# Altium schematic sheet Power_Management_System.SchDoc: Power Management System (part 2 of 3)
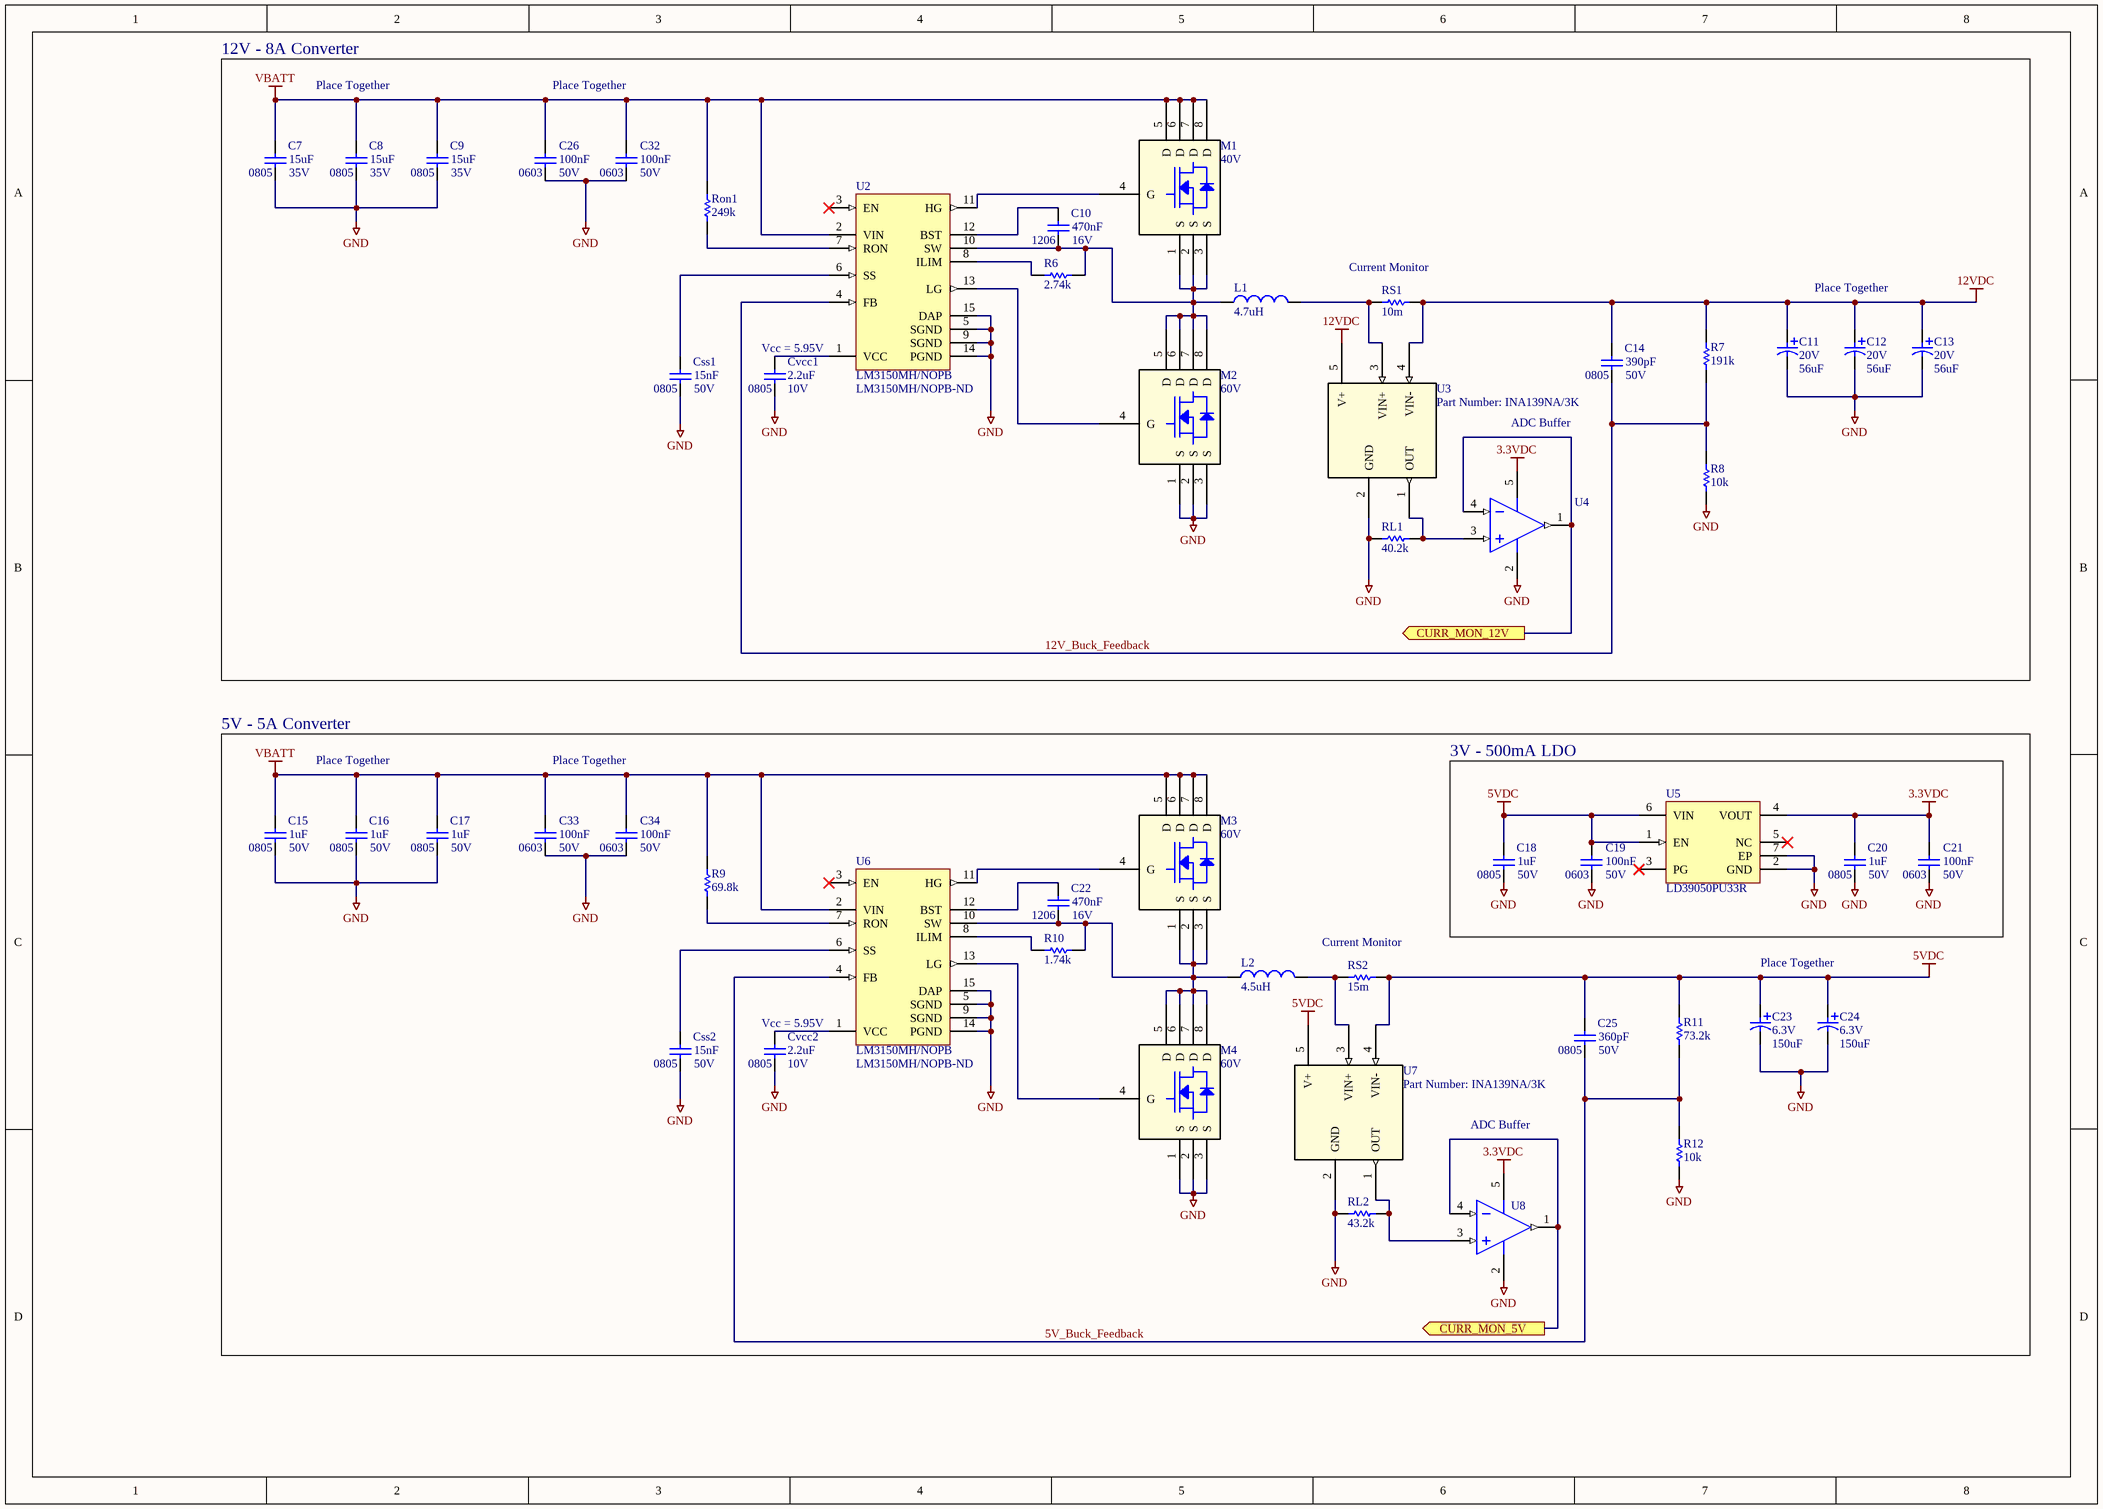
[diagram p1: Power_Management_System.SchDoc]
## Library data of the parts
C7-C9 = C2012X5R1V156M125AC: CAP CER 15UF 35V X5R 0805; Manufacturer: TDK; Dielectric Material: Ceramic; Tolerance: 20%; Supplier 1: Digi-Key; Manufacturer Part Number: C2012X5R1V156M125AC; Stock 1: 48431; Pricing 1: 1 = 0.85000, 10 = 0.62800, 100 = 0.43060, 500 = 0.34086, 1000 = 0.28704 (USD); RoHS: Yes; Mount: Surface Mount; Case Code (Metric): 2012; Case Code (Imperial): 0805; Min Operating Temperature: -55°C; Max Operating Temperature: 85°C; Package Quantity: 2000; Packaging: Tape and Reel; Dielectric: X5R; Termination: SMD/SMT; Composition: Ceramic; Voltage Rating (DC): 35V; Length: 0.079inch; Height: 1.25mm; Width: 0.049inch; Thickness: 0.057inch; Lead Free: Lead Free; ComponentLink1URL: https://datasheet.ciiva.com/14893/tdkmlcccaprange-14893918.pdf?src-supplier=Digi-Key; ComponentLink1Description: https://datasheet.ciiva.com/14893/tdkmlcccaprange-14893918.pdf?src-supplier=Digi-Key; ComponentLink2URL: https://datasheet.ciiva.com/14893/tdkmlcccaprange-14893919.pdf?src-supplier=Digi-Key; ComponentLink2Description: https://datasheet.ciiva.com/14893/tdkmlcccaprange-14893919.pdf?src-supplier=Digi-Key; Supplier Part Number 1: 445-14423-1-ND
C10 C22 = ECP-U1C474MA5: CAP FILM 0.47UF 20% 16VDC 1206; Manufacturer: Panasonic; Dielectric: PPS; Insulation Resistance: 141MR; Supplier 1: Digi-Key; Manufacturer Part Number: ECP-U1C474MA5; Stock 1: 70076; Pricing 1: 1 = 0.67000, 10 = 0.49500, 100 = 0.33950, 500 = 0.26876, 1000 = 0.22632 (USD); RoHS: Yes; Mount: Surface Mount; Case/Package: 1206; Case Code (Metric): 3216; Contact Plating: Copper; Min Operating Temperature: -40°C; Max Operating Temperature: 85°C; Tolerance: 20%; Packaging: Tape and Reel; Package Quantity: 2000; Voltage Rating (DC): 16V; Termination: SMD/SMT; Voltage: 16V; Length: 3.2mm; Height: 1.4mm; Depth: 1.6mm; Width: 1.6mm; Height - Seated (Max): 0.063inch; Radiation Hardening: No; REACH SVHC: No SVHC; Lead Free: Lead Free; ComponentLink1URL: https://datasheet.ciiva.com/11791/0900766b80f2ea72-11791506.pdf?src-supplier=RSComponents; ComponentLink1Description: https://datasheet.ciiva.com/11791/0900766b80f2ea72-11791506.pdf?src-supplier=RSComponents; ComponentLink2URL: https://datasheet.ciiva.com/15163/getdatasheetpartid-239730-15163927.pdf?src-supplier=Verical; ComponentLink2Description: https://datasheet.ciiva.com/15163/getdatasheetpartid-239730-15163927.pdf?src-supplier=Verical; ComponentLink3URL: https://datasheet.ciiva.com/11444/abd0000ce12-11444520.pdf?src-supplier=Avnet; ComponentLink3Description: https://datasheet.ciiva.com/11444/abd0000ce12-11444520.pdf?src-supplier=Avnet; ComponentLink4URL: https://datasheet.ciiva.com/17630/abd0000ce12-17630652.pdf?src-supplier=Avnet+Europe; ComponentLink4Description: https://datasheet.ciiva.com/17630/abd0000ce12-17630652.pdf?src-supplier=Avnet+Europe; ComponentLink5URL: https://datasheet.ciiva.com/5710/31740-5710142.pdf?src-supplier=Farnell; ComponentLink5Description: https://datasheet.ciiva.com/5710/31740-5710142.pdf?src-supplier=Farnell; ComponentLink6URL: https://datasheet.ciiva.com/2992/abd0000ce12-2992996.pdf?src-supplier=Avnet; ComponentLink6Description: https://datasheet.ciiva.com/2992/abd0000ce12-2992996.pdf?src-supplier=Avnet; ComponentLink7URL: https://datasheet.ciiva.com/46400/31740-46400042.pdf?src-supplier=Element14; ComponentLink7Description: https://datasheet.ciiva.com/46400/31740-46400042.pdf?src-supplier=Element14; ComponentLink8URL: https://datasheet.ciiva.com/46400/31740-46400043.pdf?src-supplier=Element14; ComponentLink8Description: https://datasheet.ciiva.com/46400/31740-46400043.pdf?src-supplier=Element14; Supplier Part Number 1: PCF1130CT-ND
C11-C13 = 20SVPF56MX: CAP ALUM POLY 56UF 20% 20V SMD; Manufacturer: Panasonic; ESR (Equivalent Series Resistance): 30mR; Ripple Current: 2.8A; Polarity: Polar; Leakage Current: 224uA; Life (Hours): 5000Hour; Dissipation Factor: 12%; Supplier 1: Digi-Key; Manufacturer Part Number: 20SVPF56MX; Stock 1: 4599; Pricing 1: 1 = 1.02000, 10 = 0.80900, 100 = 0.60650, 500 = 0.45826 (USD); RoHS: Yes; Mount: Surface Mount; Number of Pins: 6; Min Operating Temperature: -55°C; Max Operating Temperature: 105°C; Tolerance: 20%; Packaging: Tape and Reel; Voltage Rating: 20V; Ripple Current (AC): 2.8A; Package Quantity: 1500; Voltage Rating (DC): 20V; Termination: SMD/SMT; Diameter: 5mm; Length: 5.9mm; Height: 5.9mm; Height - Seated (Max): 0.236inch; REACH SVHC: No SVHC; ComponentLink1URL: https://datasheet.ciiva.com/25746/1734360-25746730.pdf?src-supplier=Farnell; ComponentLink1Description: https://datasheet.ciiva.com/25746/1734360-25746730.pdf?src-supplier=Farnell; ComponentLink2URL: https://datasheet.ciiva.com/24066/svpf-os-262415-24066271.pdf?src-supplier=Mouser; ComponentLink2Description: https://datasheet.ciiva.com/24066/svpf-os-262415-24066271.pdf?src-supplier=Mouser; ComponentLink3URL: https://datasheet.ciiva.com/48542/svpf-eng-ds-48542383.pdf?src-supplier=Distrelec; ComponentLink3Description: https://datasheet.ciiva.com/48542/svpf-eng-ds-48542383.pdf?src-supplier=Distrelec; Case/Package: Radial; Supplier Part Number 1: P16502CT-ND
C14 = C0805C391J5GACTU: CAP CER 390PF 50V C0G/NP0 0805; Manufacturer: KEMET; Dielectric Material: Ceramic; Tolerance: 5%; Dielectric: C0G; Dissipation Factor: 0.1%; Supplier 1: Digi-Key; Manufacturer Part Number: C0805C391J5GACTU; Stock 1: 200410; Pricing 1: 1 = 0.16000, 10 = 0.11500, 100 = 0.05400, 500 = 0.03788, 1000 = 0.03136 (USD); RoHS: Yes; Mount: Surface Mount; Case Code (Metric): 2012; Case Code (Imperial): 0805; Contact Material: Tin; Min Operating Temperature: -55°C; Max Operating Temperature: 125°C; Package Quantity: 1; Voltage Rating: 50V; Packaging: Tape and Reel; Voltage Rating (DC): 50V; Termination: SMD/SMT; Length: 2mm; Height: 0.78mm; Width: 0.049inch; Thickness: 0.035inch; Lead Pitch: 0.75mm; Depth: 1.25mm; Radiation Hardening: No; REACH SVHC: No SVHC; Lead Free: Lead Free; ComponentLink1URL: https://datasheet.ciiva.com/144/docfinderpartnumber-c0805c391j5gactu-144976.pdf?src-supplier=Digi-Key; ComponentLink1Description: https://datasheet.ciiva.com/144/docfinderpartnumber-c0805c391j5gactu-144976.pdf?src-supplier=Digi-Key; ComponentLink2URL: https://datasheet.ciiva.com/18100/getdatasheetpartid-35246-18100917.pdf?src-supplier=Verical; ComponentLink2Description: https://datasheet.ciiva.com/18100/getdatasheetpartid-35246-18100917.pdf?src-supplier=Verical; ComponentLink3URL: https://datasheet.ciiva.com/14601/70095383-14601640.pdf?src-supplier=Allied+Electronics; ComponentLink3Description: https://datasheet.ciiva.com/14601/70095383-14601640.pdf?src-supplier=Allied+Electronics; ComponentLink4URL: https://datasheet.ciiva.com/7842/1372242-7842602.pdf?src-supplier=Element14; ComponentLink4Description: https://datasheet.ciiva.com/7842/1372242-7842602.pdf?src-supplier=Element14; ComponentLink5URL: https://datasheet.ciiva.com/49516/1567367-49516570.pdf?src-supplier=Jameco; ComponentLink5Description: https://datasheet.ciiva.com/49516/1567367-49516570.pdf?src-supplier=Jameco; Supplier Part Number 1: 399-1132-1-ND
C15-C18 C20 = CL21A105KBCLNNC: CAP CER 1uF 50V X5R 10% SMD 0805 85C Cardboard T/R; Manufacturer: Samsung; Supplier 1: Digi-Key; Manufacturer Part Number: CL21A105KBCLNNC; Stock 1: 343658; Pricing 1: 1 = 0.17000, 10 = 0.11400, 100 = 0.05780, 500 = 0.03954, 1000 = 0.03498 (USD); RoHS: Yes; Mount: Surface Mount; Case Code (Metric): 2012; Case Code (Imperial): 0805; Min Operating Temperature: -55°C; Max Operating Temperature: 85°C; Tolerance: 10%; Package Quantity: 1; Packaging: Tape and Reel; Dielectric: X5R; Length: 2mm; Height: 0.85mm; Width: 0.049inch; Depth: 1.25mm; Thickness: 0.037inch; Radiation Hardening: No; Lead Free: Lead Free; ComponentLink1URL: https://datasheet.ciiva.com/25775/cl21a105kbclnnc-25775425.pdf?src-supplier=Digi-Key; ComponentLink1Description: https://datasheet.ciiva.com/25775/cl21a105kbclnnc-25775425.pdf?src-supplier=Digi-Key; Supplier Part Number 1: 1276-2396-1-ND
C19 C21 C26 C32-C34 = CL10B104KB8SFNC: CAP CER 0.1UF 50V X7R 0603; Manufacturer: Samsung; Tolerance: 10%; Supplier 1: Digi-Key; Manufacturer Part Number: CL10B104KB8SFNC; Stock 1: 1859763; Pricing 1: 1 = 0.10000, 10 = 0.02900, 100 = 0.01300, 500 = 0.00928, 1000 = 0.00729 (USD); RoHS: Yes; Mount: Surface Mount; Case/Package: 0603; Case Code (Metric): 1608; Contact Plating: Tin; Min Operating Temperature: -55°C; Max Operating Temperature: 125°C; Package Quantity: 4000; Packaging: Tape and Reel; Capacitance: 100nF; Dielectric: X7R; Features: Soft Termination; Length: 1.6mm; Height: 0.8mm; Width: 0.031inch; Thickness: 0.035inch; Depth: 0.8mm; Radiation Hardening: No; Lead Free: Lead Free; ComponentLink1URL: https://datasheet.ciiva.com/25714/cl10b104kb8sfnc-25714514.pdf?src-supplier=Digi-Key; ComponentLink1Description: https://datasheet.ciiva.com/25714/cl10b104kb8sfnc-25714514.pdf?src-supplier=Digi-Key; Supplier Part Number 1: 1276-1936-1-ND
C23 C24 = 6SVPE150M: CAP ALUM POLY 150UF 20% 6.3V SMD; Manufacturer: Panasonic; ESR (Equivalent Series Resistance): 12mR; Ripple Current: 3.52A; Leakage Current: 500uA; Polarity: Polar; Life (Hours): 2000Hour; Dissipation Factor: 12%; Supplier 1: Digi-Key; Manufacturer Part Number: 6SVPE150M; Stock 1: 8524; Pricing 1: 1 = 1.00000, 10 = 0.75800, 100 = 0.54210, 500 = 0.41972 (USD); RoHS: Yes; Mount: Surface Mount; Case/Package: Radial; Number of Pins: 6; Min Operating Temperature: -55°C; Max Operating Temperature: 105°C; Tolerance: 20%; Voltage Rating: 6.3V; Packaging: Tape and Reel; Voltage Rating (DC): 6.3V; Package Quantity: 1500; Ripple Current (AC): 3.52A; Termination: SMD/SMT; Diameter: 5mm; Length: 5.9mm; Height: 5.9mm; Height - Seated (Max): 0.236inch; REACH SVHC: No SVHC; Lead Free: Lead Free; ComponentLink1URL: https://datasheet.ciiva.com/25767/1734359-25767741.pdf?src-supplier=Farnell; ComponentLink1Description: https://datasheet.ciiva.com/25767/1734359-25767741.pdf?src-supplier=Farnell; Supplier Part Number 1: P16614CT-ND
C25 = CL21C361JBANNNC: CAP CER 360pF 50V C0G 5% SMD 0805 125C Paper T/R; Manufacturer: Samsung; Material: Ceramic; Supplier 1: Digi-Key; Manufacturer Part Number: CL21C361JBANNNC; Stock 1: 20000; Pricing 1: 4000 = 0.02290, 8000 = 0.02130, 12000 = 0.02024 (USD); RoHS: Yes; Mount: Surface Mount; Case Code (Metric): 2012; Case Code (Imperial): 0805; Min Operating Temperature: -55°C; Max Operating Temperature: 125°C; Tolerance: 5%; Dielectric: C0G; Package Quantity: 1; Packaging: Tape and Reel; Voltage Rating (DC): 50V; Length: 2mm; Height: 0.65mm; Depth: 1.25mm; Width: 0.049inch; Thickness: 0.03inch; Radiation Hardening: No; ComponentLink1URL: https://datasheet.ciiva.com/25772/cl21c361jbannnc-25772337.pdf?src-supplier=Digi-Key; ComponentLink1Description: https://datasheet.ciiva.com/25772/cl21c361jbannnc-25772337.pdf?src-supplier=Digi-Key; ComponentLink2URL: https://datasheet.ciiva.com/29200/453725-da-01-en-vs-kondensator-0805-29200056.pdf?src-supplier=Conrad; ComponentLink2Description: https://datasheet.ciiva.com/29200/453725-da-01-en-vs-kondensator-0805-29200056.pdf?src-supplier=Conrad; Supplier Part Number 1: 1276-2650-2-ND
Css1 Css2 = CGA4F2C0G1H153J085AA: CAP, 0.015µF, 50V, 5%, C0G/NP0, 0805; Manufacturer: TDK; Dielectric: C0G; Supplier 1: Digi-Key; Manufacturer Part Number: CGA4F2C0G1H153J085AA; Stock 1: 25718; Pricing 1: 1 = 0.33000, 10 = 0.23000, 100 = 0.13800, 500 = 0.10350, 1000 = 0.08740 (USD); RoHS: Yes; Mount: Surface Mount; Weight: 0.000194oz; Case Code (Metric): 2012; Case Code (Imperial): 0805; Min Operating Temperature: -55°C; Max Operating Temperature: 125°C; Tolerance: 5%; Packaging: Tape and Reel; Voltage Rating (DC): 50V; Termination: SMD/SMT; Package Quantity: 1; Composition: Ceramic; Length: 2mm; Height: 0.85mm; Depth: 1.25mm; Width: 0.049inch; Thickness: 0.037inch; Ratings: AEC-Q200; Lead Free: Lead Free; REACH SVHC: No SVHC; ComponentLink1URL: https://datasheet.ciiva.com/24218/cga4f2c0g1h153j085aa-265904-24218633.pdf?src-supplier=Mouser; ComponentLink1Description: https://datasheet.ciiva.com/24218/cga4f2c0g1h153j085aa-265904-24218633.pdf?src-supplier=Mouser; ComponentLink2URL: https://datasheet.ciiva.com/7975/1807242-7975403.pdf?src-supplier=Element14; ComponentLink2Description: https://datasheet.ciiva.com/7975/1807242-7975403.pdf?src-supplier=Element14; Supplier Part Number 1: 445-6948-1-ND
Cvcc1 Cvcc2 = LMK212B7225KG-T: CAP CER 2.2UF 10V X7R 0805; Manufacturer: Taiyo Yuden; Tolerance: 10%; Supplier 1: Digi-Key; Manufacturer Part Number: LMK212B7225KG-T; Stock 1: 73012; Pricing 1: 1 = 0.21000, 10 = 0.14600, 100 = 0.06880, 500 = 0.04822, 1000 = 0.03993 (USD); RoHS: Yes; Mount: Surface Mount; Case Code (Imperial): 0805; Case Code (Metric): 2012; Min Operating Temperature: -55°C; Max Operating Temperature: 125°C; Dielectric: X7R; Packaging: Tape and Reel; Package Quantity: 1; Voltage Rating (DC): 10V; Termination: SMD/SMT; Composition: Ceramic; Length: 2mm; Height: 1.25mm; Depth: 1.25mm; Width: 1.25mm; Thickness: 0.053inch; Radiation Hardening: No; Lead Free: Lead Free; REACH SVHC: Unknown; Halogen Free: Halogen Free; ComponentLink1URL: https://datasheet.ciiva.com/11464/lmk212b7225kg-t-ss-11464065.pdf?src-supplier=Avnet; ComponentLink1Description: https://datasheet.ciiva.com/11464/lmk212b7225kg-t-ss-11464065.pdf?src-supplier=Avnet; ComponentLink2URL: https://datasheet.ciiva.com/30097/950lmk212b7225kg-t-30097799.pdf?src-supplier=Onlinecomponents.com; ComponentLink2Description: https://datasheet.ciiva.com/30097/950lmk212b7225kg-t-30097799.pdf?src-supplier=Onlinecomponents.com; ComponentLink3URL: https://datasheet.ciiva.com/15921/1069lmk212b7225kg-t-15921336.pdf?src-supplier=Onlinecomponents.com; ComponentLink3Description: https://datasheet.ciiva.com/15921/1069lmk212b7225kg-t-15921336.pdf?src-supplier=Onlinecomponents.com; ComponentLink4URL: https://datasheet.ciiva.com/26872/getdatasheetpartid-637084-26872681.pdf?src-supplier=Verical; ComponentLink4Description: https://datasheet.ciiva.com/26872/getdatasheetpartid-637084-26872681.pdf?src-supplier=Verical; Supplier Part Number 1: 587-1286-1-ND
L1 = SRP1270-4R7M: FIXED IND 4.7uH 20% SMD 1270; Manufacturer: Bourns; Core Material: Ferrite; DC Resistance (DCR): 11.2mR; Max DC Current: 15A; Saturation Current: 30A; Shielding: Shielded; Self Resonant Frequency: 15MHz; Test Frequency: 100kHz; Current: 35A; Supplier 1: Digi-Key; Manufacturer Part Number: SRP1270-4R7M; Stock 1: 8527; Pricing 1: 1 = 1.68000, 10 = 1.55300, 100 = 1.08680 (USD); RoHS: Yes; Mount: Surface Mount; Case/Package: 1270; Number of Pins: 2; Min Operating Temperature: -55°C; Max Operating Temperature: 125°C; Tolerance: 20%; Packaging: Tape and Reel; Package Quantity: 400; Current Rating: 15A; Inductance Tolerance: 20%; Composition: Wirewound; Termination: SMD/SMT; RMS Current (Irms): 15A; DC Current: 15A; Military Standard: Not; Length: 13.7mm; Height: 7mm; Width: 13.7mm; Height - Seated (Max): 0.276inch; Depth: 13.7mm; REACH SVHC: No SVHC; ComponentLink1URL: https://datasheet.ciiva.com/11803/0900766b80f2b679-11803001.pdf?src-supplier=RSComponents; ComponentLink1Description: https://datasheet.ciiva.com/11803/0900766b80f2b679-11803001.pdf?src-supplier=RSComponents; ComponentLink2URL: https://datasheet.ciiva.com/17286/srp1270-17286216.pdf?src-supplier=Avnet+Europe; ComponentLink2Description: https://datasheet.ciiva.com/17286/srp1270-17286216.pdf?src-supplier=Avnet+Europe; ComponentLink3URL: https://datasheet.ciiva.com/30242/484srp1270-30242620.pdf?src-supplier=Onlinecomponents.com; ComponentLink3Description: https://datasheet.ciiva.com/30242/484srp1270-30242620.pdf?src-supplier=Onlinecomponents.com; ComponentLink4URL: https://datasheet.ciiva.com/17045/70277161-17045933.pdf?src-supplier=Allied+Electronics; ComponentLink4Description: https://datasheet.ciiva.com/17045/70277161-17045933.pdf?src-supplier=Allied+Electronics; ComponentLink5URL: https://datasheet.ciiva.com/8515/srp1270-8515814.pdf?src-supplier=Avnet; ComponentLink5Description: https://datasheet.ciiva.com/8515/srp1270-8515814.pdf?src-supplier=Avnet; ComponentLink6URL: https://datasheet.ciiva.com/8517/srp1270-8517062.pdf?src-supplier=Avnet; ComponentLink6Description: https://datasheet.ciiva.com/8517/srp1270-8517062.pdf?src-supplier=Avnet; ComponentLink7URL: https://datasheet.ciiva.com/7849/1834359-7849561.pdf?src-supplier=Element14; ComponentLink7Description: https://datasheet.ciiva.com/7849/1834359-7849561.pdf?src-supplier=Element14; Supplier Part Number 1: SRP1270-4R7MCT-ND
L2 = SRR1208-4R5ML: FIXED IND 4.5UH 6.5A 14 MOHM SMD; Manufacturer: Bourns; Core Material: Ferrite; Material: Steel; Tolerance: 20%; DC Resistance (DCR): 14mR; Saturation Current: 10A; Shielding: Shielded; Self Resonant Frequency: 30MHz; Q Factor: 24; Test Frequency: 1kHz; Supplier 1: Digi-Key; Manufacturer Part Number: SRR1208-4R5ML; Stock 1: 831; Pricing 1: 1 = 1.13000, 10 = 1.04700, 100 = 0.75670 (USD); RoHS: Yes; Mount: Surface Mount; Case/Package: 1208; Min Operating Temperature: -40°C; Max Operating Temperature: 125°C; Max DC Current: 6.5A; Packaging: Tape and Reel; Package Quantity: 400; Current Rating: 6.5A; Frequency: 30MHz; Inductance Tolerance: 20%; Resistance: 14MR; Composition: Wirewound; Termination: SMD/SMT; DC Current: 6.5A; Military Standard: Not; RMS Current (Irms): 6.5A; Length: 12.7mm; Height: 8.5mm; Width: 0.5inch; Height - Seated (Max): 0.335inch; Depth: 13mm; REACH SVHC: No SVHC; ComponentLink1URL: https://datasheet.ciiva.com/11803/0900766b80defdeb-11803005.pdf?src-supplier=RSComponents; ComponentLink1Description: https://datasheet.ciiva.com/11803/0900766b80defdeb-11803005.pdf?src-supplier=RSComponents; ComponentLink2URL: https://datasheet.ciiva.com/1060/srr1208-1060209.pdf?src-supplier=Digi-Key; ComponentLink2Description: https://datasheet.ciiva.com/1060/srr1208-1060209.pdf?src-supplier=Digi-Key; ComponentLink3URL: https://datasheet.ciiva.com/1060/srr1208-1060210.pdf?src-supplier=Digi-Key; ComponentLink3Description: https://datasheet.ciiva.com/1060/srr1208-1060210.pdf?src-supplier=Digi-Key; ComponentLink4URL: https://datasheet.ciiva.com/30091/srr1208-30091109.pdf?src-supplier=Onlinecomponents.com; ComponentLink4Description: https://datasheet.ciiva.com/30091/srr1208-30091109.pdf?src-supplier=Onlinecomponents.com; ComponentLink5URL: https://datasheet.ciiva.com/17285/srr1208-17285910.pdf?src-supplier=Avnet+Europe; ComponentLink5Description: https://datasheet.ciiva.com/17285/srr1208-17285910.pdf?src-supplier=Avnet+Europe; ComponentLink6URL: https://datasheet.ciiva.com/7849/1483756-7849582.pdf?src-supplier=Element14; ComponentLink6Description: https://datasheet.ciiva.com/7849/1483756-7849582.pdf?src-supplier=Element14; Supplier Part Number 1: SRR1208-4R5MLCT-ND
M1 = CSD18504Q5A: MOSFET N-CH 40V 8SON; Manufacturer: Texas Instruments; Rise Time: 6.8ns; Continuous Drain Current (ID): 50A; Turn-Off Delay Time: 12ns; Fall Time: 2ns; Gate to Source Voltage (Vgs): 20V; Turn-On Delay Time: 3.2ns; Rds On Max: 6.6mR; Max Power Dissipation: 3.1W; Drain to Source Resistance: 7.5mR; Element Configuration: Single; Input Capacitance: 1.656nF; Threshold Voltage: 1.9V; Number of Elements: 1; Supplier 1: Digi-Key; Manufacturer Part Number: CSD18504Q5A; Stock 1: 72450; Pricing 1: 1 = 1.12000, 10 = 0.99000, 100 = 0.78230, 500 = 0.60668, 1000 = 0.47895 (USD); RoHS: Yes; Mount: Surface Mount; Number of Pins: 8; Contact Plating: Tin; Min Operating Temperature: -55°C; Max Operating Temperature: 150°C; Package Quantity: 1; Packaging: Tape and Reel; Drain to Source Breakdown Voltage: 40V; Power Dissipation: 3.1W; Length: 5.8mm; Height: 1.1mm; Width: 5mm; Radiation Hardening: No; REACH SVHC: No SVHC; ComponentLink1URL: https://datasheet.ciiva.com/14192/csd18504q5a-14192913.pdf?src-supplier=Avnet; ComponentLink1Description: https://datasheet.ciiva.com/14192/csd18504q5a-14192913.pdf?src-supplier=Avnet; ComponentLink2URL: https://datasheet.ciiva.com/13063/csd18504q5a-123974-13063385.pdf?src-supplier=Mouser; ComponentLink2Description: https://datasheet.ciiva.com/13063/csd18504q5a-123974-13063385.pdf?src-supplier=Mouser; ComponentLink3URL: https://datasheet.ciiva.com/6386/csd18504q5a-6386886.pdf?src-supplier=Digi-Key; ComponentLink3Description: https://datasheet.ciiva.com/6386/csd18504q5a-6386886.pdf?src-supplier=Digi-Key; ComponentLink4URL: https://datasheet.ciiva.com/6386/csd18504q5a-6386887.pdf?src-supplier=Digi-Key; ComponentLink4Description: https://datasheet.ciiva.com/6386/csd18504q5a-6386887.pdf?src-supplier=Digi-Key; ComponentLink5URL: https://datasheet.ciiva.com/6386/csd18504q5a-6386888.pdf?src-supplier=Digi-Key; ComponentLink5Description: https://datasheet.ciiva.com/6386/csd18504q5a-6386888.pdf?src-supplier=Digi-Key; ComponentLink6URL: https://datasheet.ciiva.com/26147/csd18504q5a-26147849.pdf?src-supplier=Avnet+Europe; ComponentLink6Description: https://datasheet.ciiva.com/26147/csd18504q5a-26147849.pdf?src-supplier=Avnet+Europe; Supplier Part Number 1: 296-30572-1-ND
M2-M4 = CSD18537NQ5A: MOSFET N-CH 60V 50A 8-Pin VSON-FET EP T/R; Manufacturer: Texas Instruments; Rise Time: 4ns; Continuous Drain Current (ID): 62A; Gate to Source Voltage (Vgs): 20V; Fall Time: 3.2ns; Turn-Off Delay Time: 14.4ns; Turn-On Delay Time: 5.8ns; Rds On Max: 13mR; Input Capacitance: 1.48nF; Max Power Dissipation: 3.2W; Element Configuration: Single; Nominal Vgs: 3V; Number of Elements: 1; Supplier 1: Digi-Key; Manufacturer Part Number: CSD18537NQ5A; Stock 1: 21532; Pricing 1: 1 = 0.94000, 10 = 0.83000, 100 = 0.65610, 500 = 0.50882, 1000 = 0.40170 (USD); RoHS: Yes; Mount: Surface Mount; Number of Pins: 8; Contact Plating: Copper; Min Operating Temperature: -55°C; Max Operating Temperature: 150°C; Package Quantity: 2500; Packaging: Tape and Reel; Drain to Source Resistance: 13mR; Drain to Source Breakdown Voltage: 60V; Power Dissipation: 3.2W; Radiation Hardening: No; REACH SVHC: No SVHC; Lead Free: Contains Lead; ComponentLink1URL: https://datasheet.ciiva.com/24021/slps391a-316771-24021744.pdf?src-supplier=Mouser; ComponentLink1Description: https://datasheet.ciiva.com/24021/slps391a-316771-24021744.pdf?src-supplier=Mouser; ComponentLink2URL: https://datasheet.ciiva.com/23803/1762822-23803793.pdf?src-supplier=Newark; ComponentLink2Description: https://datasheet.ciiva.com/23803/1762822-23803793.pdf?src-supplier=Newark; ComponentLink3URL: https://datasheet.ciiva.com/29755/csd18537nq5a-29755636.pdf?src-supplier=Digi-Key; ComponentLink3Description: https://datasheet.ciiva.com/29755/csd18537nq5a-29755636.pdf?src-supplier=Digi-Key; ComponentLink4URL: https://datasheet.ciiva.com/25645/csd18537nq5a-25645525.pdf?src-supplier=Digi-Key; ComponentLink4Description: https://datasheet.ciiva.com/25645/csd18537nq5a-25645525.pdf?src-supplier=Digi-Key; ComponentLink5URL: https://datasheet.ciiva.com/30021/csd18537nq5a-30021926.pdf?src-supplier=Avnet; ComponentLink5Description: https://datasheet.ciiva.com/30021/csd18537nq5a-30021926.pdf?src-supplier=Avnet; ComponentLink6URL: https://datasheet.ciiva.com/30021/csd18537nq5a-30021927.pdf?src-supplier=Avnet; ComponentLink6Description: https://datasheet.ciiva.com/30021/csd18537nq5a-30021927.pdf?src-supplier=Avnet; ComponentLink7URL: https://datasheet.ciiva.com/18566/csd18537nq5a-18566856.pdf?src-supplier=Digi-Key; ComponentLink7Description: https://datasheet.ciiva.com/18566/csd18537nq5a-18566856.pdf?src-supplier=Digi-Key; Supplier Part Number 1: 296-36455-1-ND
R6 = ERJ-6ENF2741V: RES SMD 2.74K OHM 1% 1/8W 0805; Manufacturer: Panasonic; Voltage Rating: 150V; Power Rating: 125mW; Temperature Coefficient: 100ppm/°C; Supplier 1: Digi-Key; Manufacturer Part Number: ERJ-6ENF2741V; Stock 1: 212786; Pricing 1: 1 = 0.10000, 10 = 0.08100, 100 = 0.03110, 1000 = 0.01367, 2500 = 0.01181 (USD); RoHS: Yes; Mount: Surface Mount; Case/Package: 0805; Weight: 0.000194oz; Case Code (Metric): 2012; Case Code (Imperial): 0805; Contact Plating: Tin; Min Operating Temperature: -55°C; Max Operating Temperature: 155°C; Tolerance: 1%; Packaging: Tape and Reel; Package Quantity: 5000; Composition: Thick Film; Number of Terminations: 2; Termination: SMD/SMT; Military Standard: Not; Max Power Dissipation: 125mW; Voltage Rating (DC): 150V; Length: 2mm; Height: 0.6mm; Width: 0.049inch; Depth: 1.25mm; Radiation Hardening: No; REACH SVHC: No SVHC; Lead Free: Lead Free; ComponentLink1URL: https://datasheet.ciiva.com/34303/1989210-34303628.pdf?src-supplier=Jameco; ComponentLink1Description: https://datasheet.ciiva.com/34303/1989210-34303628.pdf?src-supplier=Jameco; ComponentLink2URL: https://datasheet.ciiva.com/16773/70260748-16773765.pdf?src-supplier=Allied+Electronics; ComponentLink2Description: https://datasheet.ciiva.com/16773/70260748-16773765.pdf?src-supplier=Allied+Electronics; ComponentLink3URL: https://datasheet.ciiva.com/46389/426256-46389477.pdf?src-supplier=Element14; ComponentLink3Description: https://datasheet.ciiva.com/46389/426256-46389477.pdf?src-supplier=Element14; ComponentLink4URL: https://datasheet.ciiva.com/6129/426256-6129654.pdf?src-supplier=Farnell; ComponentLink4Description: https://datasheet.ciiva.com/6129/426256-6129654.pdf?src-supplier=Farnell; ComponentLink5URL: https://datasheet.ciiva.com/30134/aoa0000ce2-30134518.pdf?src-supplier=Onlinecomponents.com; ComponentLink5Description: https://datasheet.ciiva.com/30134/aoa0000ce2-30134518.pdf?src-supplier=Onlinecomponents.com; ComponentLink6URL: https://datasheet.ciiva.com/24162/aoa0000ce2-24162695.pdf?src-supplier=Mouser; ComponentLink6Description: https://datasheet.ciiva.com/24162/aoa0000ce2-24162695.pdf?src-supplier=Mouser; ComponentLink7URL: https://datasheet.ciiva.com/9196/aoa0000ce2-9196826.pdf?src-supplier=Avnet; ComponentLink7Description: https://datasheet.ciiva.com/9196/aoa0000ce2-9196826.pdf?src-supplier=Avnet; ComponentLink8URL: https://datasheet.ciiva.com/15159/getdatasheetpartid-32746-15159322.pdf?src-supplier=Verical; ComponentLink8Description: https://datasheet.ciiva.com/15159/getdatasheetpartid-32746-15159322.pdf?src-supplier=Verical; ComponentLink9URL: https://datasheet.ciiva.com/46377/426256-46377834.pdf?src-supplier=Element14; ComponentLink9Description: https://datasheet.ciiva.com/46377/426256-46377834.pdf?src-supplier=Element14; ComponentLink10URL: https://datasheet.ciiva.com/28531/1678782-28531694.pdf?src-supplier=Element14; ComponentLink10Description: https://datasheet.ciiva.com/28531/1678782-28531694.pdf?src-supplier=Element14; Supplier Part Number 1: P2.74KCCT-ND
R7 = ERJ-6ENF1913V: RES SMD 191K OHM 1% 1/8W 0805; Manufacturer: Panasonic; Power Rating: 125mW; Voltage Rating: 150V; Temperature Coefficient: 100ppm/°C; Supplier 1: Digi-Key; Manufacturer Part Number: ERJ-6ENF1913V; Stock 1: 22046; Pricing 1: 1 = 0.10000, 10 = 0.08100, 100 = 0.03110, 1000 = 0.01367, 2500 = 0.01181 (USD); RoHS: Yes; Mount: Surface Mount; Case/Package: 0805; Case Code (Imperial): 0805; Case Code (Metric): 2012; Contact Plating: Tin; Min Operating Temperature: -55°C; Max Operating Temperature: 155°C; Tolerance: 1%; Packaging: Tape and Reel; Package Quantity: 1; Composition: Thick Film; Number of Terminations: 2; Military Standard: Not; Max Power Dissipation: 125mW; Voltage Rating (DC): 150V; Features: Automotive AEC-Q200; Length: 2mm; Height: 0.028inch; Width: 1.2mm; Depth: 1.25mm; REACH SVHC: No SVHC; Lead Free: Lead Free; ComponentLink1URL: https://datasheet.ciiva.com/22729/1678782-22729194.pdf?src-supplier=Farnell; ComponentLink1Description: https://datasheet.ciiva.com/22729/1678782-22729194.pdf?src-supplier=Farnell; Supplier Part Number 1: P191KCCT-ND
R8 R12 = CRCW080510K0FKEA: RES SMD 10K OHM 1% 1/8W 0805; Manufacturer: Vishay; Temperature Coefficient: 100ppm/°C; Power Rating: 125mW; Voltage Rating: 150V; Supplier 1: Digi-Key; Manufacturer Part Number: CRCW080510K0FKEA; Stock 1: 374664; Pricing 1: 1 = 0.10000, 10 = 0.06600, 100 = 0.02670, 1000 = 0.01199, 2500 = 0.01041 (USD); RoHS: Yes; Case/Package: 0805; Weight: 0.000194oz; Contact Plating: Tin; Case Code (Imperial): 0805; Case Code (Metric): 2012; Min Operating Temperature: -55°C; Max Operating Temperature: 155°C; Tolerance: 1%; Composition: Thick Film; Packaging: Tape and Reel; Package Quantity: 5000; Military Standard: Not; Termination: SMD/SMT; Voltage Rating (DC): 150V; Length: 2mm; Height: 0.45mm; Width: 1.25mm; Depth: 1.25mm; Radiation Hardening: No; Lead Free: Lead Free; REACH SVHC: Unknown; ComponentLink1URL: https://datasheet.ciiva.com/11808/0900766b80d98b26-11808216.pdf?src-supplier=RSComponents; ComponentLink1Description: https://datasheet.ciiva.com/11808/0900766b80d98b26-11808216.pdf?src-supplier=RSComponents; ComponentLink2URL: https://datasheet.ciiva.com/16514/dcrcwe3-16514907.pdf?src-supplier=Avnet+Asia; ComponentLink2Description: https://datasheet.ciiva.com/16514/dcrcwe3-16514907.pdf?src-supplier=Avnet+Asia; ComponentLink3URL: https://datasheet.ciiva.com/16883/dcrcwe3-16883708.pdf?src-supplier=Avnet+Europe; ComponentLink3Description: https://datasheet.ciiva.com/16883/dcrcwe3-16883708.pdf?src-supplier=Avnet+Europe; ComponentLink4URL: https://datasheet.ciiva.com/8337/dcrcwe3-8337773.pdf?src-supplier=Avnet; ComponentLink4Description: https://datasheet.ciiva.com/8337/dcrcwe3-8337773.pdf?src-supplier=Avnet; ComponentLink5URL: https://datasheet.ciiva.com/16755/70201119-16755389.pdf?src-supplier=Allied+Electronics; ComponentLink5Description: https://datasheet.ciiva.com/16755/70201119-16755389.pdf?src-supplier=Allied+Electronics; ComponentLink6URL: https://datasheet.ciiva.com/46394/1720486-46394381.pdf?src-supplier=Element14; ComponentLink6Description: https://datasheet.ciiva.com/46394/1720486-46394381.pdf?src-supplier=Element14; ComponentLink7URL: https://datasheet.ciiva.com/8337/dcrcwe3-8337774.pdf?src-supplier=Avnet; ComponentLink7Description: https://datasheet.ciiva.com/8337/dcrcwe3-8337774.pdf?src-supplier=Avnet; ComponentLink8URL: https://datasheet.ciiva.com/16199/dcrcwe3-16199086.pdf?src-supplier=Future+Electronics; ComponentLink8Description: https://datasheet.ciiva.com/16199/dcrcwe3-16199086.pdf?src-supplier=Future+Electronics; ComponentLink9URL: https://datasheet.ciiva.com/5547/dcrcwe3-109170-5547559.pdf?src-supplier=Mouser; ComponentLink9Description: https://datasheet.ciiva.com/5547/dcrcwe3-109170-5547559.pdf?src-supplier=Mouser; ComponentLink10URL: https://datasheet.ciiva.com/16719/70201119-16719082.pdf?src-supplier=Allied+Electronics; ComponentLink10Description: https://datasheet.ciiva.com/16719/70201119-16719082.pdf?src-supplier=Allied+Electronics; Supplier Part Number 1: 541-10.0KCCT-ND
R9 = ERJ-6ENF6982V: RES SMD 69.8K OHM 1% 1/8W 0805; Manufacturer: Panasonic; Voltage Rating: 150V; Power Rating: 125mW; Temperature Coefficient: 100ppm/°C; Supplier 1: Digi-Key; Manufacturer Part Number: ERJ-6ENF6982V; Stock 1: 129613; Pricing 1: 1 = 0.10000, 10 = 0.08100, 100 = 0.03110, 1000 = 0.01367, 2500 = 0.01181 (USD); RoHS: Yes; Mount: Surface Mount; Case/Package: 0805; Case Code (Metric): 2012; Case Code (Imperial): 0805; Contact Plating: Tin; Min Operating Temperature: -55°C; Max Operating Temperature: 155°C; Packaging: Tape and Reel; Tolerance: 1%; Package Quantity: 1; Composition: Thick Film; Number of Terminations: 2; Termination: SMD/SMT; Military Standard: Not; Max Power Dissipation: 125mW; Voltage Rating (DC): 150V; Features: Automotive AEC-Q200; Length: 2mm; Height: 0.6mm; Width: 0.049inch; Depth: 1.25mm; Height - Seated (Max): 0.028inch; Radiation Hardening: No; REACH SVHC: Unknown; Lead Free: Lead Free; ComponentLink1URL: https://datasheet.ciiva.com/22682/1678782-22682501.pdf?src-supplier=Element14; ComponentLink1Description: https://datasheet.ciiva.com/22682/1678782-22682501.pdf?src-supplier=Element14; ComponentLink2URL: https://datasheet.ciiva.com/24027/aoa0000ce2-24027573.pdf?src-supplier=Mouser; ComponentLink2Description: https://datasheet.ciiva.com/24027/aoa0000ce2-24027573.pdf?src-supplier=Mouser; ComponentLink3URL: https://datasheet.ciiva.com/7937/aoa0000ce2-7937462.pdf?src-supplier=Element14; ComponentLink3Description: https://datasheet.ciiva.com/7937/aoa0000ce2-7937462.pdf?src-supplier=Element14; ComponentLink4URL: https://datasheet.ciiva.com/22730/1678782-22730040.pdf?src-supplier=Farnell; ComponentLink4Description: https://datasheet.ciiva.com/22730/1678782-22730040.pdf?src-supplier=Farnell; ComponentLink5URL: https://datasheet.ciiva.com/28592/1694929-28592344.pdf?src-supplier=Element14; ComponentLink5Description: https://datasheet.ciiva.com/28592/1694929-28592344.pdf?src-supplier=Element14; ComponentLink6URL: https://datasheet.ciiva.com/9187/aoa0000ce2-9187962.pdf?src-supplier=Avnet; ComponentLink6Description: https://datasheet.ciiva.com/9187/aoa0000ce2-9187962.pdf?src-supplier=Avnet; ComponentLink7URL: https://datasheet.ciiva.com/16789/70260748-16789163.pdf?src-supplier=Allied+Electronics; ComponentLink7Description: https://datasheet.ciiva.com/16789/70260748-16789163.pdf?src-supplier=Allied+Electronics; Supplier Part Number 1: P69.8KCCT-ND
R10 = ERJ6ENF1741V: RES SMD 1.74K OHM 1% 1/8W 0805; Manufacturer: Panasonic; Power Rating: 125mW; Voltage Rating: 150V; Temperature Coefficient: 100ppm/°C; Supplier 1: Digi-Key; Manufacturer Part Number: ERJ6ENF1741V; Stock 1: 142494; Pricing 1: 1 = 0.10000, 10 = 0.08100, 100 = 0.03110, 1000 = 0.01367, 2500 = 0.01181 (USD); RoHS: Yes; Mount: Surface Mount; Case/Package: 0805; Case Code (Metric): 2012; Case Code (Imperial): 0805; Contact Plating: Tin; Min Operating Temperature: -55°C; Max Operating Temperature: 155°C; Tolerance: 1%; Packaging: Tape and Reel; Package Quantity: 1; Composition: Thick Film; Number of Terminations: 2; Termination: SMD/SMT; Military Standard: Not; Max Power Dissipation: 125mW; Voltage Rating (DC): 150V; Features: Automotive AEC-Q200; Length: 2mm; Height: 0.6mm; Width: 0.049inch; Depth: 1.25mm; REACH SVHC: Unknown; Lead Free: Lead Free; ComponentLink1URL: https://datasheet.ciiva.com/3883/3984280s8821682n1386-3883650.pdf?src-supplier=Arrow; ComponentLink1Description: https://datasheet.ciiva.com/3883/3984280s8821682n1386-3883650.pdf?src-supplier=Arrow; ComponentLink2URL: https://datasheet.ciiva.com/22743/1678782-22743561.pdf?src-supplier=Farnell; ComponentLink2Description: https://datasheet.ciiva.com/22743/1678782-22743561.pdf?src-supplier=Farnell; ComponentLink3URL: https://datasheet.ciiva.com/46437/1678782-46437836.pdf?src-supplier=Element14; ComponentLink3Description: https://datasheet.ciiva.com/46437/1678782-46437836.pdf?src-supplier=Element14; ComponentLink4URL: https://datasheet.ciiva.com/22682/1678782-22682493.pdf?src-supplier=Element14; ComponentLink4Description: https://datasheet.ciiva.com/22682/1678782-22682493.pdf?src-supplier=Element14; ComponentLink5URL: https://datasheet.ciiva.com/9197/aoa0000ce2-9197802.pdf?src-supplier=Avnet; ComponentLink5Description: https://datasheet.ciiva.com/9197/aoa0000ce2-9197802.pdf?src-supplier=Avnet; ComponentLink6URL: https://datasheet.ciiva.com/24071/aoa0000ce2-24071082.pdf?src-supplier=Mouser; ComponentLink6Description: https://datasheet.ciiva.com/24071/aoa0000ce2-24071082.pdf?src-supplier=Mouser; ComponentLink7URL: https://datasheet.ciiva.com/16762/70260748-16762251.pdf?src-supplier=Allied+Electronics; ComponentLink7Description: https://datasheet.ciiva.com/16762/70260748-16762251.pdf?src-supplier=Allied+Electronics; Supplier Part Number 1: P1.74KCCT-ND
R11 = ERJ-6ENF7322V: RES SMD 73.2K OHM 1% 1/8W 0805; Manufacturer: Panasonic; Power Rating: 125mW; Voltage Rating: 150V; Temperature Coefficient: 100ppm/°C; Supplier 1: Digi-Key; Manufacturer Part Number: ERJ-6ENF7322V; Stock 1: 155375; Pricing 1: 1 = 0.10000, 10 = 0.08100, 100 = 0.03110, 1000 = 0.01367, 2500 = 0.01181 (USD); RoHS: Yes; Mount: Surface Mount; Case/Package: 0805; Case Code (Metric): 2012; Case Code (Imperial): 0805; Contact Plating: Tin; Min Operating Temperature: -55°C; Max Operating Temperature: 155°C; Tolerance: 1%; Packaging: Tape and Reel; Package Quantity: 1; Composition: Thick Film; Number of Terminations: 2; Termination: SMD/SMT; Military Standard: Not; Max Power Dissipation: 125mW; Voltage Rating (DC): 150V; Features: Automotive AEC-Q200; Length: 2mm; Height: 0.028inch; Width: 0.049inch; Depth: 1.25mm; REACH SVHC: Yes; Lead Free: Contains Lead; ComponentLink1URL: https://datasheet.ciiva.com/22682/1678782-22682502.pdf?src-supplier=Element14; ComponentLink1Description: https://datasheet.ciiva.com/22682/1678782-22682502.pdf?src-supplier=Element14; ComponentLink2URL: https://datasheet.ciiva.com/7862/aoa0000ce2-7862010.pdf?src-supplier=Element14; ComponentLink2Description: https://datasheet.ciiva.com/7862/aoa0000ce2-7862010.pdf?src-supplier=Element14; ComponentLink3URL: https://datasheet.ciiva.com/15830/aoa0000ce2-15830506.pdf?src-supplier=Onlinecomponents.com; ComponentLink3Description: https://datasheet.ciiva.com/15830/aoa0000ce2-15830506.pdf?src-supplier=Onlinecomponents.com; ComponentLink4URL: https://datasheet.ciiva.com/46373/1678782-46373845.pdf?src-supplier=Element14; ComponentLink4Description: https://datasheet.ciiva.com/46373/1678782-46373845.pdf?src-supplier=Element14; ComponentLink5URL: https://datasheet.ciiva.com/9187/aoa0000ce2-9187800.pdf?src-supplier=Avnet; ComponentLink5Description: https://datasheet.ciiva.com/9187/aoa0000ce2-9187800.pdf?src-supplier=Avnet; ComponentLink6URL: https://datasheet.ciiva.com/24061/aoa0000ce2-24061742.pdf?src-supplier=Mouser; ComponentLink6Description: https://datasheet.ciiva.com/24061/aoa0000ce2-24061742.pdf?src-supplier=Mouser; Supplier Part Number 1: P73.2KCCT-ND
RL1 = ERA3AEB4022V: RES SMD 40.2K OHM 0.1% 1/10W 0603; Manufacturer: Panasonic; Temperature Coefficient: 25ppm/°C; Power Rating: 100mW; Voltage Rating: 75V; Supplier 1: Digi-Key; Manufacturer Part Number: ERA3AEB4022V; Stock 1: 72800; Pricing 1: 1 = 0.35000, 10 = 0.30000, 100 = 0.11720, 1000 = 0.04906, 2500 = 0.04498 (USD); RoHS: Yes; Mount: Surface Mount; Case/Package: 0603; Number of Pins: 2; Contact Plating: Tin; Case Code (Metric): 1608; Case Code (Imperial): 0603; Min Operating Temperature: -55°C; Max Operating Temperature: 155°C; Tolerance: 0.1%; Composition: Thin Film; Packaging: Tape and Reel; Package Quantity: 1; Number of Terminations: 2; Military Standard: Not; Max Power Dissipation: 100mW; Voltage Rating (DC): 75V; Features: Automotive AEC-Q200; Length: 1.6mm; Height: 0.45mm; Width: 0.8mm; Depth: 0.8mm; Radiation Hardening: No; REACH SVHC: No SVHC; Lead Free: Lead Free; ComponentLink1URL: https://datasheet.ciiva.com/11809/0900766b80eb1d8c-11809819.pdf?src-supplier=RSComponents; ComponentLink1Description: https://datasheet.ciiva.com/11809/0900766b80eb1d8c-11809819.pdf?src-supplier=RSComponents; ComponentLink2URL: https://datasheet.ciiva.com/9189/aoa0000ce26-9189881.pdf?src-supplier=Avnet; ComponentLink2Description: https://datasheet.ciiva.com/9189/aoa0000ce26-9189881.pdf?src-supplier=Avnet; ComponentLink3URL: https://datasheet.ciiva.com/7870/485442-7870587.pdf?src-supplier=Element14; ComponentLink3Description: https://datasheet.ciiva.com/7870/485442-7870587.pdf?src-supplier=Element14; ComponentLink4URL: https://datasheet.ciiva.com/6129/485442-6129390.pdf?src-supplier=Farnell; ComponentLink4Description: https://datasheet.ciiva.com/6129/485442-6129390.pdf?src-supplier=Farnell; Supplier Part Number 1: P40.2KDBCT-ND
RL2 = ERA3AEB4322V: RES SMD 43.2K OHM 0.1% 1/10W 0603; Manufacturer: Panasonic; Temperature Coefficient: 25ppm/°C; Power Rating: 100mW; Voltage Rating: 75V; Supplier 1: Digi-Key; Manufacturer Part Number: ERA3AEB4322V; Stock 1: 70685; Pricing 1: 1 = 0.35000, 10 = 0.30000, 100 = 0.11720, 1000 = 0.04906, 2500 = 0.04498 (USD); RoHS: Yes; Mount: Surface Mount; Case/Package: 0603; Number of Pins: 2; Contact Plating: Tin; Case Code (Metric): 1608; Case Code (Imperial): 0603; Min Operating Temperature: -55°C; Max Operating Temperature: 155°C; Tolerance: 0.1%; Composition: Thin Film; Packaging: Tape and Reel; Package Quantity: 1; Number of Terminations: 2; Termination: SMD/SMT; Military Standard: Not; Max Power Dissipation: 100mW; Voltage Rating (DC): 75V; Features: Automotive AEC-Q200; Length: 1.6mm; Height: 0.45mm; Width: 0.8mm; Depth: 0.8mm; Radiation Hardening: No; REACH SVHC: No SVHC; Lead Free: Lead Free; ComponentLink1URL: https://datasheet.ciiva.com/11814/0900766b80eb1d8c-11814843.pdf?src-supplier=RSComponents; ComponentLink1Description: https://datasheet.ciiva.com/11814/0900766b80eb1d8c-11814843.pdf?src-supplier=RSComponents; ComponentLink2URL: https://datasheet.ciiva.com/7861/485442-7861685.pdf?src-supplier=Element14; ComponentLink2Description: https://datasheet.ciiva.com/7861/485442-7861685.pdf?src-supplier=Element14; ComponentLink3URL: https://datasheet.ciiva.com/5968/485442-5968894.pdf?src-supplier=Farnell; ComponentLink3Description: https://datasheet.ciiva.com/5968/485442-5968894.pdf?src-supplier=Farnell; ComponentLink4URL: https://datasheet.ciiva.com/9189/aoa0000ce26-9189639.pdf?src-supplier=Avnet; ComponentLink4Description: https://datasheet.ciiva.com/9189/aoa0000ce26-9189639.pdf?src-supplier=Avnet; ComponentLink5URL: https://datasheet.ciiva.com/5968/485442-5968890.pdf?src-supplier=Farnell; ComponentLink5Description: https://datasheet.ciiva.com/5968/485442-5968890.pdf?src-supplier=Farnell; Supplier Part Number 1: P43.2KDBCT-ND
Ron1 = CRCW0805249KFKEA: RES SMD 249K OHM 1% 1/8W 0805; Manufacturer: Vishay; Power Rating: 125mW; Temperature Coefficient: 100ppm/°C; Voltage Rating: 150V; Supplier 1: Digi-Key; Manufacturer Part Number: CRCW0805249KFKEA; Stock 1: 10745; Pricing 1: 1 = 0.10000, 10 = 0.06600, 100 = 0.02670, 1000 = 0.01199, 2500 = 0.01041 (USD); RoHS: Yes; Case/Package: 0805; Weight: 0.000194oz; Contact Plating: Tin; Case Code (Metric): 2012; Case Code (Imperial): 0805; Min Operating Temperature: -55°C; Max Operating Temperature: 155°C; Tolerance: 1%; Composition: Thick Film; Packaging: Tape and Reel; Package Quantity: 10; Number of Terminations: 2; Termination: SMD/SMT; Max Power Dissipation: 125mW; Features: Automotive AEC-Q200; Military Standard: Not; Voltage Rating (DC): 150V; Length: 2mm; Height: 0.45mm; Width: 0.049inch; Depth: 1.25mm; Radiation Hardening: No; Lead Free: Lead Free; REACH SVHC: Unknown; ComponentLink1URL: https://datasheet.ciiva.com/11810/0900766b80d98b26-11810118.pdf?src-supplier=RSComponents; ComponentLink1Description: https://datasheet.ciiva.com/11810/0900766b80d98b26-11810118.pdf?src-supplier=RSComponents; ComponentLink2URL: https://datasheet.ciiva.com/8953/dcrcwe3-8953862.pdf?src-supplier=Avnet; ComponentLink2Description: https://datasheet.ciiva.com/8953/dcrcwe3-8953862.pdf?src-supplier=Avnet; ComponentLink3URL: https://datasheet.ciiva.com/2495/dcrcwe3-2495575.pdf?src-supplier=Digi-Key; ComponentLink3Description: https://datasheet.ciiva.com/2495/dcrcwe3-2495575.pdf?src-supplier=Digi-Key; ComponentLink4URL: https://datasheet.ciiva.com/2495/dcrcwe3-2495576.pdf?src-supplier=Digi-Key; ComponentLink4Description: https://datasheet.ciiva.com/2495/dcrcwe3-2495576.pdf?src-supplier=Digi-Key; ComponentLink5URL: https://datasheet.ciiva.com/3258/dcrcwe3-3258360.pdf?src-supplier=Avnet; ComponentLink5Description: https://datasheet.ciiva.com/3258/dcrcwe3-3258360.pdf?src-supplier=Avnet; ComponentLink6URL: https://datasheet.ciiva.com/2495/dcrcwe3-2495577.pdf?src-supplier=Digi-Key; ComponentLink6Description: https://datasheet.ciiva.com/2495/dcrcwe3-2495577.pdf?src-supplier=Digi-Key; ComponentLink7URL: https://datasheet.ciiva.com/16853/dcrcwe3-16853034.pdf?src-supplier=Avnet+Europe; ComponentLink7Description: https://datasheet.ciiva.com/16853/dcrcwe3-16853034.pdf?src-supplier=Avnet+Europe; ComponentLink8URL: https://datasheet.ciiva.com/22709/1533075-22709070.pdf?src-supplier=Element14; ComponentLink8Description: https://datasheet.ciiva.com/22709/1533075-22709070.pdf?src-supplier=Element14; ComponentLink9URL: https://datasheet.ciiva.com/5550/dcrcwe3-109170-5550479.pdf?src-supplier=Mouser; ComponentLink9Description: https://datasheet.ciiva.com/5550/dcrcwe3-109170-5550479.pdf?src-supplier=Mouser; ComponentLink10URL: https://datasheet.ciiva.com/7674/1533075-7674111.pdf?src-supplier=Element14; ComponentLink10Description: https://datasheet.ciiva.com/7674/1533075-7674111.pdf?src-supplier=Element14; Supplier Part Number 1: 541-249KCCT-ND; Value: 249k
RS1 = CRA2512-FZ-R010ELF: RES SMD 10 MOHM, 2512 [6432 Metric], 3 W,  1%, CR Series; Manufacturer: Bourns; Power Rating: 3W; Temperature Coefficient: 75ppm/°C; Supplier 1: Allied Electronics; Manufacturer Part Number: CRA2512-FZ-R010ELF; Stock 1: 0; Pricing 1: 8000 = 0.22000 (USD); RoHS: Yes; Mount: Surface Mount; Case/Package: 2512; Number of Pins: 2; Contact Plating: Tin; Case Code (Imperial): 2512; Case Code (Metric): 6432; Min Operating Temperature: -55°C; Max Operating Temperature: 170°C; Tolerance: 1%; Packaging: Tape and Reel; Package Quantity: 1; Termination: SMD/SMT; Composition: Metal Film; Number of Terminations: 2; Military Standard: Not; Max Power Dissipation: 3W; Features: Moisture Resistant; Length: 6.4mm; Height: 0.6mm; Width: 3.2mm; Depth: 3.2mm; Radiation Hardening: No; REACH SVHC: No SVHC; ComponentLink1URL: https://datasheet.ciiva.com/15225/getdatasheetpartid-73855-15225377.pdf?src-supplier=Verical; ComponentLink1Description: https://datasheet.ciiva.com/15225/getdatasheetpartid-73855-15225377.pdf?src-supplier=Verical; ComponentLink2URL: https://datasheet.ciiva.com/22692/1828418-22692561.pdf?src-supplier=Element14; ComponentLink2Description: https://datasheet.ciiva.com/22692/1828418-22692561.pdf?src-supplier=Element14; ComponentLink3URL: https://datasheet.ciiva.com/11810/0900766b80ddce06-11810742.pdf?src-supplier=RSComponents; ComponentLink3Description: https://datasheet.ciiva.com/11810/0900766b80ddce06-11810742.pdf?src-supplier=RSComponents; ComponentLink4URL: https://datasheet.ciiva.com/2481/cra-2481796.pdf?src-supplier=Digi-Key; ComponentLink4Description: https://datasheet.ciiva.com/2481/cra-2481796.pdf?src-supplier=Digi-Key; ComponentLink5URL: https://datasheet.ciiva.com/2481/cra-2481797.pdf?src-supplier=Digi-Key; ComponentLink5Description: https://datasheet.ciiva.com/2481/cra-2481797.pdf?src-supplier=Digi-Key; ComponentLink6URL: https://datasheet.ciiva.com/16775/70154444-16775925.pdf?src-supplier=Allied+Electronics; ComponentLink6Description: https://datasheet.ciiva.com/16775/70154444-16775925.pdf?src-supplier=Allied+Electronics; ComponentLink7URL: https://datasheet.ciiva.com/2481/cra-2481798.pdf?src-supplier=Digi-Key; ComponentLink7Description: https://datasheet.ciiva.com/2481/cra-2481798.pdf?src-supplier=Digi-Key; ComponentLink8URL: https://datasheet.ciiva.com/16941/cra-16941096.pdf?src-supplier=Avnet+Europe; ComponentLink8Description: https://datasheet.ciiva.com/16941/cra-16941096.pdf?src-supplier=Avnet+Europe; ComponentLink9URL: https://datasheet.ciiva.com/1480/1849485-1480650.pdf?src-supplier=Element14; ComponentLink9Description: https://datasheet.ciiva.com/1480/1849485-1480650.pdf?src-supplier=Element14; ComponentLink10URL: https://datasheet.ciiva.com/30143/937cra-30143262.pdf?src-supplier=Onlinecomponents.com; ComponentLink10Description: https://datasheet.ciiva.com/30143/937cra-30143262.pdf?src-supplier=Onlinecomponents.com; Supplier Part Number 1: 70154444
RS2 = CRA2512-FZ-R015ELF: RES SMD 15 MOHM 1% 3W 2512; Manufacturer: Bourns; Temperature Coefficient: 75ppm/°C; Supplier 1: Digi-Key; Manufacturer Part Number: CRA2512-FZ-R015ELF; Stock 1: 23418; Pricing 1: 1 = 0.69000, 10 = 0.57800, 25 = 0.49560, 50 = 0.44600, 100 = 0.38810, 250 = 0.34684, 500 = 0.28078, 1000 = 0.22710 (USD); RoHS: Yes; Mount: Surface Mount; Case/Package: 2512; Case Code (Metric): 6432; Case Code (Imperial): 2512; Min Operating Temperature: -55°C; Max Operating Temperature: 170°C; Power Rating: 3W; Tolerance: 1%; Packaging: Tape and Reel; Package Quantity: 1; Composition: Metal Film; Number of Terminations: 2; Military Standard: Not; Termination: Solder; Max Power Dissipation: 3W; Features: Moisture Resistant; Length: 0.254inch; Height: 0.035inch; Width: 0.126inch; Depth: 3.2mm; REACH SVHC: No SVHC; Lead Free: Lead Free; ComponentLink1URL: https://datasheet.ciiva.com/11809/0900766b80ddce06-11809887.pdf?src-supplier=RSComponents; ComponentLink1Description: https://datasheet.ciiva.com/11809/0900766b80ddce06-11809887.pdf?src-supplier=RSComponents; ComponentLink2URL: https://datasheet.ciiva.com/6548/cra-6548395.pdf?src-supplier=Digi-Key; ComponentLink2Description: https://datasheet.ciiva.com/6548/cra-6548395.pdf?src-supplier=Digi-Key; ComponentLink3URL: https://datasheet.ciiva.com/6548/cra-6548411.pdf?src-supplier=Digi-Key; ComponentLink3Description: https://datasheet.ciiva.com/6548/cra-6548411.pdf?src-supplier=Digi-Key; ComponentLink4URL: https://datasheet.ciiva.com/6548/cra-6548413.pdf?src-supplier=Digi-Key; ComponentLink4Description: https://datasheet.ciiva.com/6548/cra-6548413.pdf?src-supplier=Digi-Key; ComponentLink5URL: https://datasheet.ciiva.com/48692/001055548-da-01-en-wid-cra2512-fz-r015elf-0-015-ohm-3w-1-48692039.pdf?src-supplier=Conrad; ComponentLink5Description: https://datasheet.ciiva.com/48692/001055548-da-01-en-wid-cra2512-fz-r015elf-0-015-ohm-3w-1-48692039.pdf?src-supplier=Conrad; Supplier Part Number 1: CRA2512-FZ-R015ELFCT-ND